# EAGLE design moth_v2 (EAGLE 9.4.1)
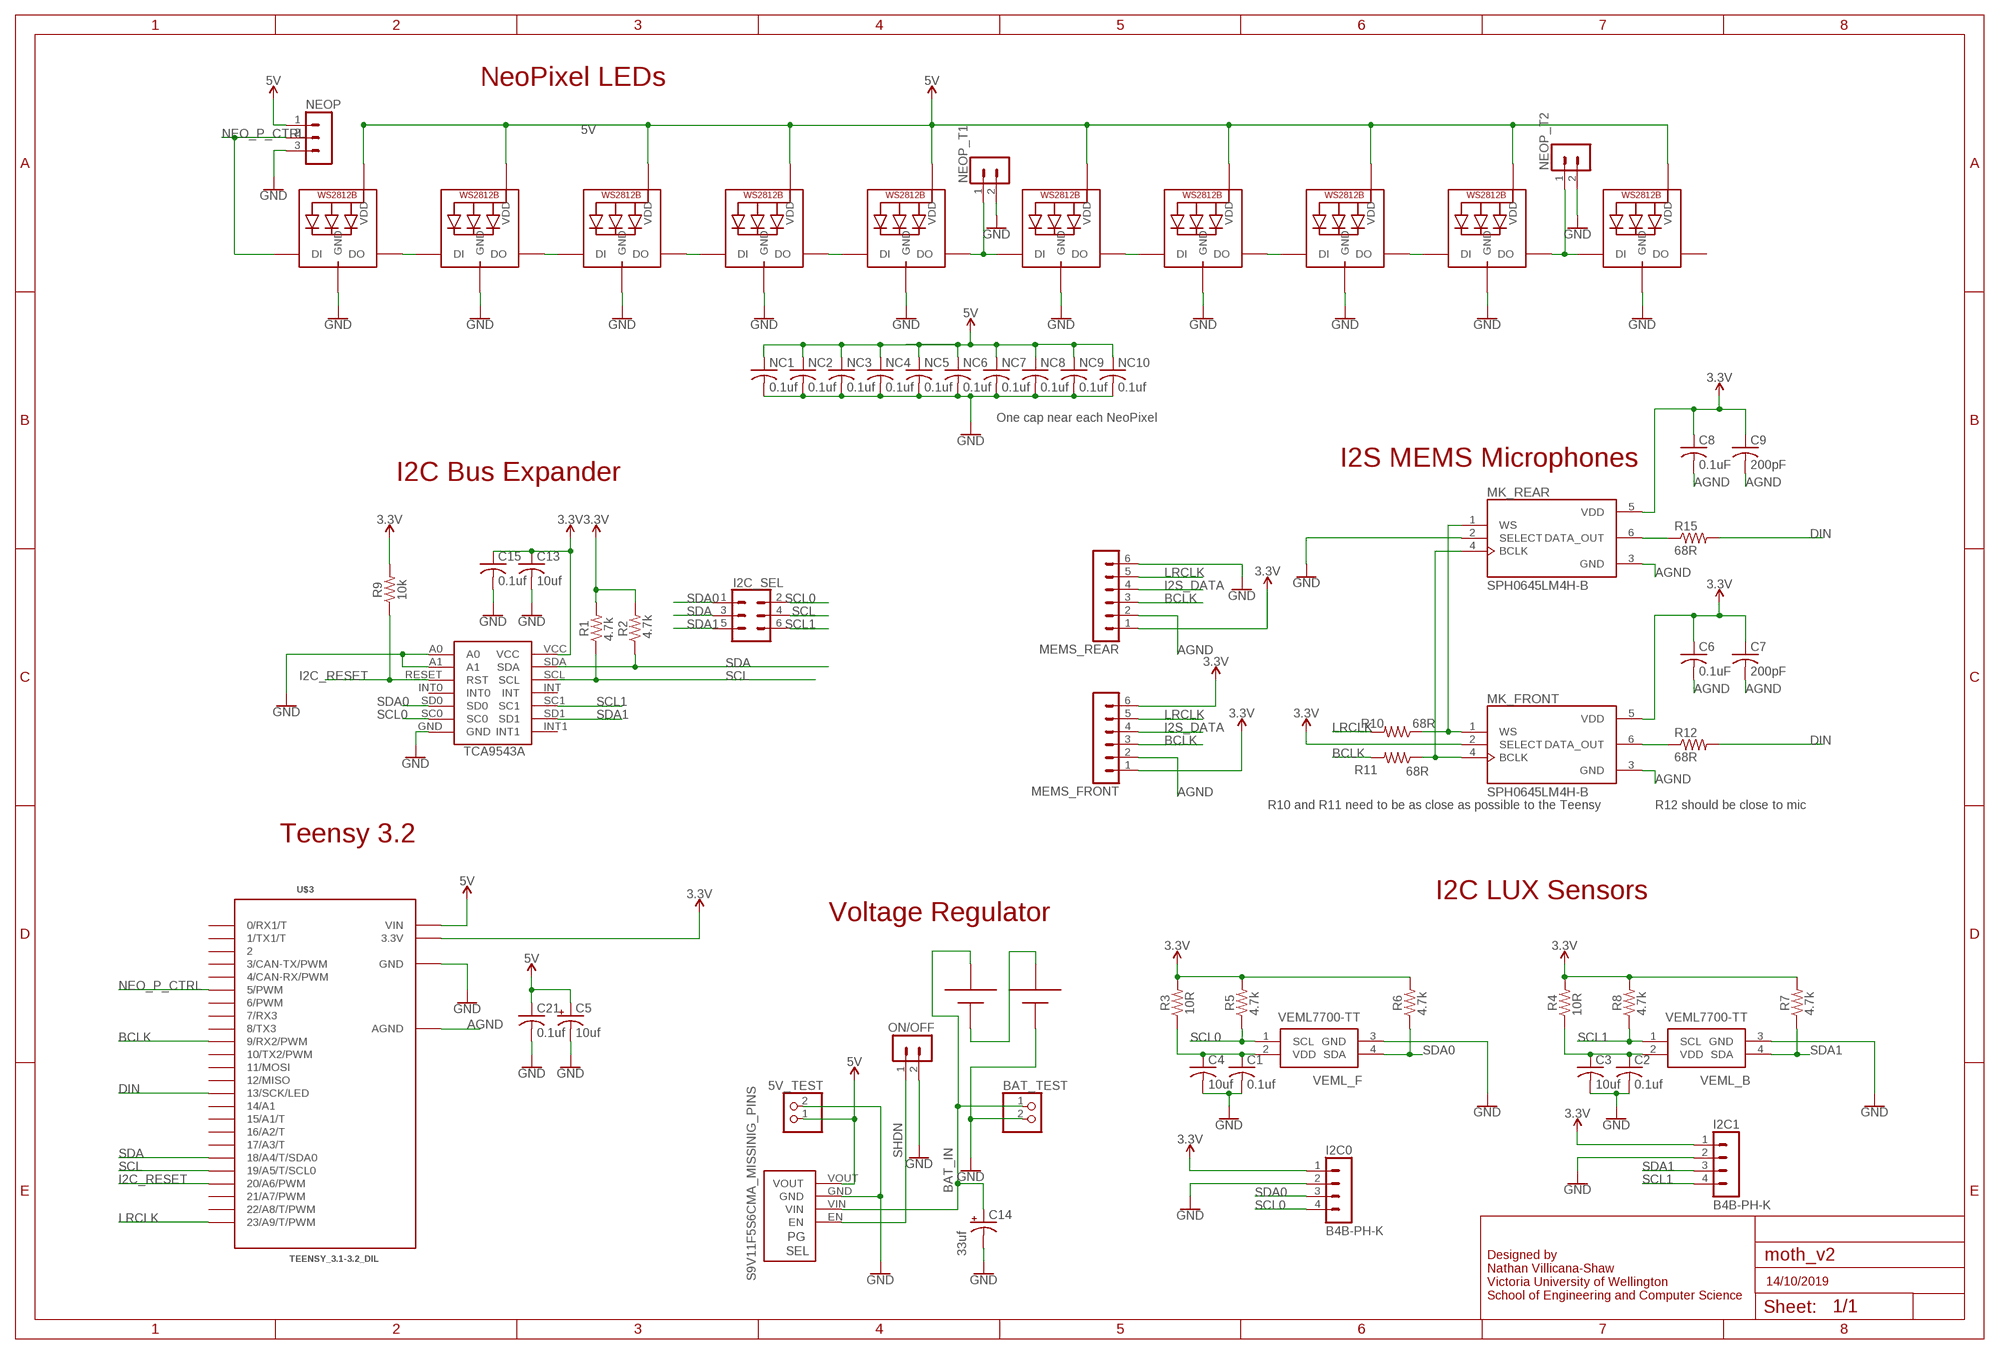
[diagram p0: schematic, sheet 1]

## Parts
5V_TEST  PINHD-1X2  [1X02]
BAT_TEST  PINHD-1X2  [1X02]
C1  0.1uf  C-USC1206K  [C1206K]
C2  0.1uf  C-USC1206K  [C1206K]
C3  10uf  C-USC1206K  [C1206K]
C4  10uf  C-USC1206K  [C1206K]
C5  10uf  CPOL-USE2.5-6  [E2,5-6]
C6  0.1uF  C-USC1206K  [C1206K]
C7  200pF  C-USC1206K  [C1206K]
C8  0.1uF  C-USC1206K  [C1206K]
C9  200pF  C-USC1206K  [C1206K]
C13  10uf  C-USC1206K  [C1206K]
C14  33uf  CPOL-USE2-5  [E2-5]
C15  0.1uf  C-USC1206K  [C1206K]
C21  0.1uf  C-USC1206K  [C1206K]
I2C0  B4B-PH-K  [B4B-PH-K]
I2C1  B4B-PH-K  [B4B-PH-K]
I2C_SEL  FEMALE 2x3  CONN_03X2FEMALE  [2X3]
MEMS_FRONT  B6B-PH-K  [B6B-PH-K]
MEMS_REAR  B6B-PH-K  [B6B-PH-K]
MK_FRONT  SPH0645LM4H-B  [MIC_SPH0645LM4H-B]
MK_REAR  SPH0645LM4H-B  [MIC_SPH0645LM4H-B]
NC1  0.1uf  C-USC1206K  [C1206K]
NC2  0.1uf  C-USC1206K  [C1206K]
NC3  0.1uf  C-USC1206K  [C1206K]
NC4  0.1uf  C-USC1206K  [C1206K]
NC5  0.1uf  C-USC1206K  [C1206K]
NC6  0.1uf  C-USC1206K  [C1206K]
NC7  0.1uf  C-USC1206K  [C1206K]
NC8  0.1uf  C-USC1206K  [C1206K]
NC9  0.1uf  C-USC1206K  [C1206K]
NC10  0.1uf  C-USC1206K  [C1206K]
NEO1  WS2812B5050  [WS2812B]
NEO2  WS2812B5050  [WS2812B]
NEO3  WS2812B5050  [WS2812B]
NEO4  WS2812B5050  [WS2812B]
NEO5  WS2812B5050  [WS2812B]
NEO6  WS2812B5050  [WS2812B]
NEO7  WS2812B5050  [WS2812B]
NEO8  WS2812B5050  [WS2812B]
NEO9  WS2812B5050  [WS2812B]
NEO10  WS2812B5050  [WS2812B]
NEOP  B3B-PH-K  [B3B-PH-K]
NEOP_T1  B2B-PH-K  [B2B-PH-K]
NEOP_T2  B2B-PH-K  [B2B-PH-K]
ON/OFF  B2B-PH-K  [B2B-PH-K]
R1  4.7k  R-US_R1206W  [R1206W]
R2  4.7k  R-US_R1206W  [R1206W]
R3  10R  R-US_R1206W  [R1206W]
R4  10R  R-US_R1206W  [R1206W]
R5  4.7k  R-US_R1206W  [R1206W]
R6  4.7k  R-US_R1206W  [R1206W]
R7  4.7k  R-US_R1206W  [R1206W]
R8  4.7k  R-US_R1206W  [R1206W]
R9  10k  R-US_R1206W  [R1206W]
R10  68R  R-US_M1206  [M1206]
R11  68R  R-US_M1206  [M1206]
R12  68R  R-US_M1206  [M1206]
R15  68R  R-US_M1206  [M1206]
U$1  TCA9543A  [SO14]
U$2  BK-18650-PC4  [18650-PC4]
U$3  TEENSY_3.1-3.2_DIL  [TEENSY_3.0-3.2&LC_DIL]
U$6  S9V11F5S6CMA_MISSINIG_PINS  [S9V11F3S5CMA_MISSING_PINS]
VEML_B  VEML7700-TT  [VEML7700]
VEML_F  VEML7700-TT  [VEML7700]

## Nets
3.3V: C6.1 C7.1 C8.1 C9.1 C13.1 C15.1 I2C0.1 I2C1.1 MEMS_FRONT.1 MEMS_FRONT.6 MEMS_REAR.1 MK_FRONT.2(SELECT) MK_FRONT.5(VDD) MK_REAR.5(VDD) R1.2 R2.2 R3.2 R4.2 R5.2 R6.2 R7.2 R8.2 R9.2 U$1.VCC U$3.3.3V
5V: 5V_TEST.1 C5.+ C21.1 NC1.1 NC2.1 NC3.1 NC4.1 NC5.1 NC6.1 NC7.1 NC8.1 NC9.1 NC10.1 NEO1.1-VDD(VDD) NEO2.1-VDD(VDD) NEO3.1-VDD(VDD) NEO4.1-VDD(VDD) NEO5.1-VDD(VDD) NEO6.1-VDD(VDD) NEO7.1-VDD(VDD) NEO8.1-VDD(VDD) NEO9.1-VDD(VDD) NEO10.1-VDD(VDD) NEOP.1 U$3.VIN U$6.VOUT
AGND: C6.2 C7.2 C8.2 C9.2 MEMS_FRONT.2 MEMS_REAR.2 MK_FRONT.3(GND) MK_REAR.3(GND) U$3.AGND
BAT_IN: BAT_TEST.1 C14.+ U$2.+1 U$6.VIN
BCLK: MEMS_FRONT.3 MEMS_REAR.3 R11.2 U$3.9(9/RX2/PWM)
BCLK_P: MK_FRONT.4(BCLK) MK_REAR.4(BCLK) R11.1
DIN: R12.2 R15.2 U$3.13(13/SCK/LED)
GND: 5V_TEST.2 BAT_TEST.2 C1.2 C2.2 C3.2 C4.2 C5.- C13.2 C14.- C15.2 C21.2 I2C0.2 I2C1.2 MEMS_REAR.6 MK_REAR.2(SELECT) NC1.2 NC2.2 NC3.2 NC4.2 NC5.2 NC6.2 NC7.2 NC8.2 NC9.2 NC10.2 NEO1.3-GND(GND) NEO2.3-GND(GND) NEO3.3-GND(GND) NEO4.3-GND(GND) NEO5.3-GND(GND) NEO6.3-GND(GND) NEO7.3-GND(GND) NEO8.3-GND(GND) NEO9.3-GND(GND) NEO10.3-GND(GND) NEOP.3 NEOP_T1.2 NEOP_T2.2 ON/OFF.2 U$1.A0 U$1.A1 U$1.GND U$2.-2 U$3.GND U$6.GND VEML_B.3(GND) VEML_F.3(GND)
I2C_RESET: R9.1 U$1.RESET(RST) U$3.20/A6(20/A6/PWM)
I2S_DATA: MEMS_FRONT.4 MEMS_REAR.4
LRCLK: MEMS_FRONT.5 MEMS_REAR.5 R10.2 U$3.23/A9(23/A9/T/PWM)
LRCLK_P: MK_FRONT.1(WS) MK_REAR.1(WS) R10.1
N$1: C1.1 C4.1 R3.1 VEML_F.2(VDD)
N$2: C2.1 C3.1 R4.1 VEML_B.2(VDD)
N$3: MK_FRONT.6(DATA_OUT) R12.1
N$4: NEO2.2-DOUT(DO) NEO3.4-DIN(DI)
N$5: NEO5.2-DOUT(DO) NEO6.4-DIN(DI) NEOP_T1.1
N$6: NEO9.2-DOUT(DO) NEO10.4-DIN(DI) NEOP_T2.1
N$8: NEO4.2-DOUT(DO) NEO5.4-DIN(DI)
N$10: NEO3.2-DOUT(DO) NEO4.4-DIN(DI)
N$11: NEO7.2-DOUT(DO) NEO8.4-DIN(DI)
N$12: NEO8.2-DOUT(DO) NEO9.4-DIN(DI)
N$17: MK_REAR.6(DATA_OUT) R15.1
N$20: U$2.+2 U$2.-1
N$23: NEO6.2-DOUT(DO) NEO7.4-DIN(DI)
NEO_P1: NEO1.2-DOUT(DO) NEO2.4-DIN(DI)
NEO_P_CTRL: NEO1.4-DIN(DI) NEOP.2 U$3.5(5/PWM)
SCL: I2C_SEL.4 R1.1 U$1.SCL U$3.19/A5(19/A5/T/SCL0)
SCL0: I2C0.4 I2C_SEL.2 R5.1 U$1.SC0 VEML_F.1(SCL)
SCL1: I2C1.4 I2C_SEL.6 R8.1 U$1.SC1 VEML_B.1(SCL)
SDA: I2C_SEL.3 R2.1 U$1.SDA U$3.18/A4(18/A4/T/SDA0)
SDA0: I2C0.3 I2C_SEL.1 R6.1 U$1.SD0 VEML_F.4(SDA)
SDA1: I2C1.3 I2C_SEL.5 R7.1 U$1.SD1 VEML_B.4(SDA)
SHDN: ON/OFF.1 U$6.EN
Unconnected: NEO10.2-DOUT(DO) U$1.INT U$1.INT0 U$1.INT1 U$3.0(0/RX1/T) U$3.1(1/TX1/T) U$3.2 U$3.3(3/CAN-TX/PWM) U$3.4(4/CAN-RX/PWM) U$3.6(6/PWM) U$3.7(7/RX3) U$3.8(8/TX3) U$3.10(10/TX2/PWM) U$3.11(11/MOSI) U$3.12(12/MISO) U$3.14/A0(14/A1) U$3.15/A1(15/A1/T) U$3.16/A2(16/A2/T) U$3.17/A3(17/A3/T) U$3.21/A7(21/A7/PWM) U$3.22/A8(22/A8/T/PWM)

## Notes on the sheet
- NeoPixel LEDs
- One cap near each NeoPixel
- I2S MEMS Microphones
- I2C Bus Expander
- 10k
- 4.7k | 4.7k
- R10 and R11 need to be as close as possible to the Teensy | R12 should be close to mic
- Teensy 3.2
- I2C LUX Sensors
- Voltage Regulator
- 10R | 4.7k | 4.7k | 10R | 4.7k | 4.7k
- 14/10/2019
- Designed by
  Nathan Villicana-Shaw
  Victoria University of Wellington
  School of Engineering and Computer Science

## Library data of the parts
5V_TEST BAT_TEST = pinhead:PINHD-1X2: PIN HEADER
C1-C4 C6-C9 C13 C15 C21 NC1-NC10 = adafruit:C-US: CAPACITOR, American symbol
C5 C14 = adafruit:CPOL-US: POLARIZED CAPACITOR, American symbol
I2C0 I2C1 = con-jst-ph:B4B-PH-K: HEADER
I2C_SEL = SparkFun-Connectors:CONN_03X2: Multi connection point. Often used as Generic Header-pin footprint for 0.1 inch spaced/style header connections You can populate with any combo of single row headers, but if you'd like an exact match, check these: Header - 2x3 (Male, 0.1") <https://www.sparkfun.com/products/12807> (PRT-12807) Header - 2x3 (Female, 0.1") <https://www.sparkfun.com/products/13010> (PRT-13010) 2x3 Pin Shrouded Header <https://www.sparkfun.com/products/10877> (PRT-10877) On any of the 0.1 inch spaced packages, you can populate with these: Break Away Headers - Straight <https://www.sparkfun.com/products/116> (PRT-00116) Break Away Male Headers - Right Angle <https://www.sparkfun.com/products/553> (PRT-00553) Female Headers <https://www.sparkfun.com/products/115> (PRT-00115) Break Away Headers - Machine Pin <https://www.sparkfun.com/products/117> (PRT-00117) Break Away Female Headers - Swiss Machine Pin <https://www.sparkfun.com/products/743> (PRT-00743) Special note: the shrouded connector mates well with our 3x2 ribbon cables: Ribbon Crimp Connector - 6-pin (2x3, Female) <https://www.sparkfun.com/products/10651> (PRT-10651) Ribbon Cable - 6 wire (15ft) <https://www.sparkfun.com/products/10646> (PRT-10646); PROD_ID: CONN-11566
MEMS_FRONT MEMS_REAR = con-jst-ph:B6B-PH-K: HEADER
MK_FRONT MK_REAR = SPH0645LM4H-B:SPH0645LM4H-B: Mic Mems Digital I2s Omni -26db; DESCRIPTION: Mic Mems Digital I2s Omni -26db; DIGI-KEY_PART_NUMBER: 423-1405-1-ND; DIGI-KEY_PURCHASE_URL: https://www.digikey.co.nz/product-detail/en/knowles/SPH0645LM4H-B/423-1405-1-ND/5332432?utm_source=snapeda&utm_medium=aggregator&utm_campaign=symbol; MF: Knowles; MP: SPH0645LM4H-B; PACKAGE: SIP-7 Bourns
NEO1-NEO10 = adafruit:WS2812B
NEOP = con-jst-ph:B3B-PH-K: HEADER
NEOP_T1 NEOP_T2 ON/OFF = con-jst-ph:B2B-PH-K: HEADER
R1-R12 R15 = adafruit:R-US_: RESISTOR, American symbol
U$1 = nathans-custom-parts:TCA9543A
U$2 = BK-18650-PC4:BK-18650-PC4; AVAILABILITY: Unavailable; DESCRIPTION: Holder Batt Li-Ion 2cell 4pc Pin; MF: MPD; MP: BK-18650-PC4; PACKAGE: None; PRICE: None
U$3 = Teensy_3_and_LC_Series_Boards_v1.4:TEENSY_3.1-3.2_DIL: Teensy 3.1 or 3.2 in a DIL Layout.
U$6 = nathans-custom-parts:S9V11F5S6CMA_MISSINIG_PINS
VEML_B VEML_F = VEML7700-TT:VEML7700-TT: 16Bit Ambient Light Sensor I2C 6.8x2.3mm Source: Datasheet <https://www.arrow.com/en/products/veml7700-tt/vishay>; DESCRIPTION: 16Bit Ambient Light Sensor I2C 6.8x2.3mm; HEIGHT: mm; MANUFACTURER_NAME: Vishay; MANUFACTURER_PART_NUMBER: VEML7700-TT; MOUSER_PART_NUMBER: 78-VEML7700-TT; MOUSER_PRICE-STOCK: https://www.mouser.com/Search/Refine.aspx?Keyword=78-VEML7700-TT; RS_PART_NUMBER: 1226791P; RS_PRICE-STOCK: http://uk.rs-online.com/web/p/products/1226791P

## Net classes
0 default: width 0.203 mm, drill 0.254 mm, clearance 0.203 mm

## Board
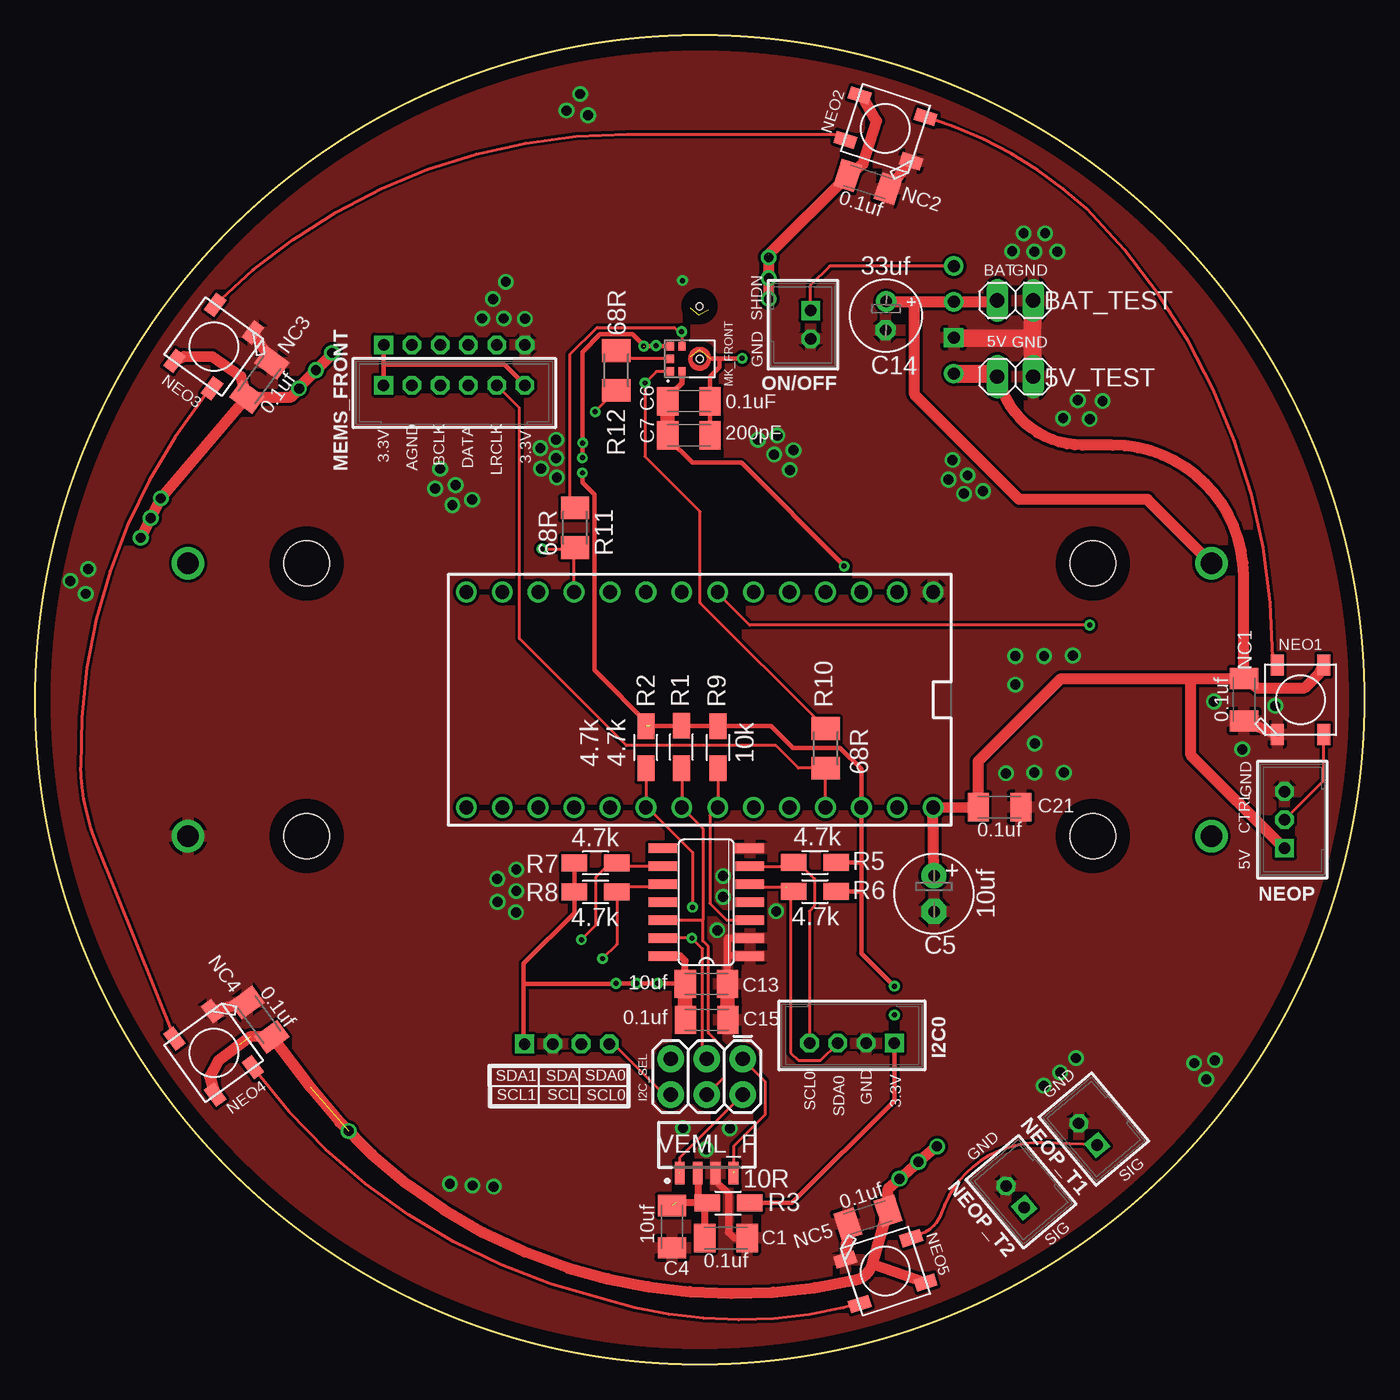
[diagram p1: board, top side]
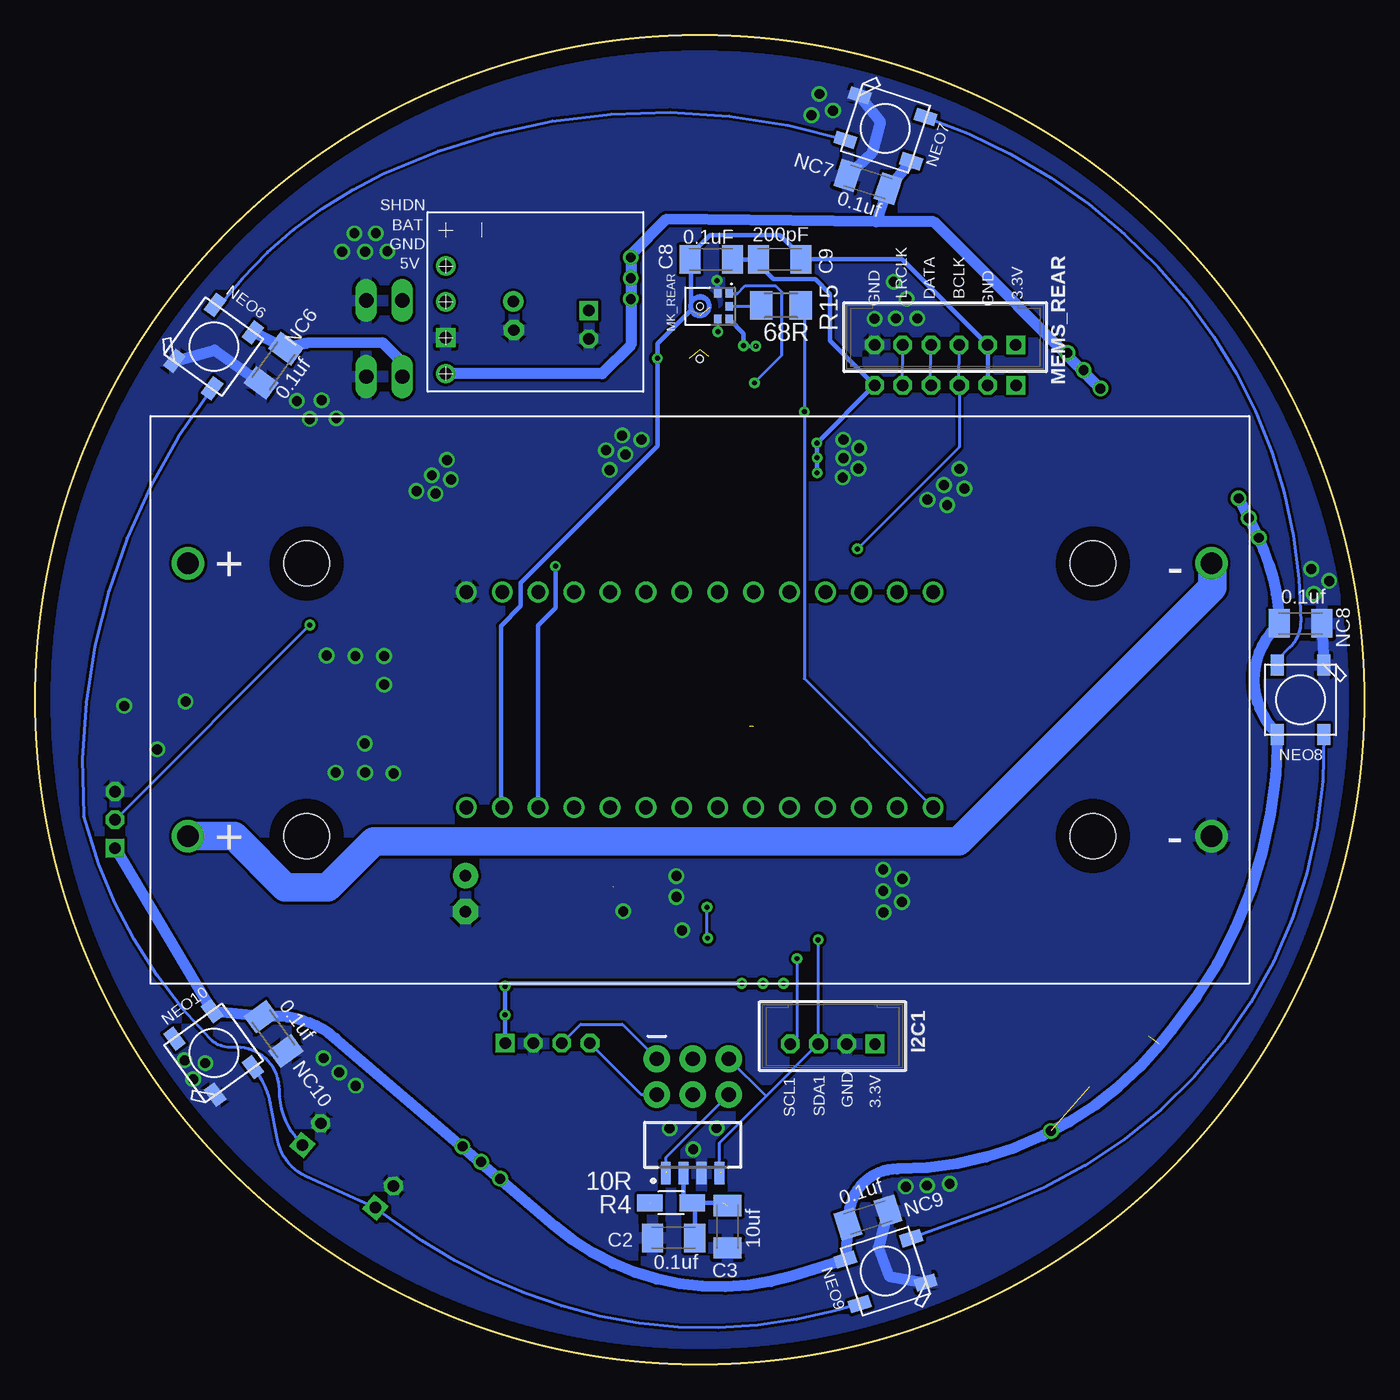
[diagram p2: board, bottom side, seen from below]

Size 94 x 94 mm. Coordinates in mm from the lower left corner, seen from the top.
Outline: circle at 47,47 radius 47
Copper layers (1*16): Top 0.035mm / dielectric 1.5mm / Bottom 0.035mm
Design rules "PCBway": minimum track width 6mil, minimum drill 0.3mm, track to track 0.205mm, track to pad 0.205mm, pad to pad 0.205mm, via to via 0.205mm, smd to smd 8mil, copper to edge 40mil, drill to drill 8mil, minimum pad ring 10mil, minimum via ring 8mil, stop-mask expansion 4mil, vias tented up to drill 25mil, thermal gap 10mil

### Footprints (pad centres in the part's own frame; a part is rotated, then mirrored left to right if it is on the bottom)
1X02 = drill 1.016 long: 1 -1.27,0; 2 1.27,0
C1206K = smd 1.5 x 2: 1 -1.5,0; 2 1.5,0
E2,5-6 = drill 0.813 pad 1.778: + -1.27,0 | drill 0.813 pad 1.778 octagon: - 1.27,0
E2-5 = drill 0.813 pad 1.422: + -1.016,0 | drill 0.813 pad 1.422 octagon: - 1.016,0
B4B-PH-K = drill 0.813 square: 1 -3,0 | drill 0.813 octagon: 2 -1,0; 3 1,0; 4 3,0
2X3 = drill 1.016 pad 1.88: 1 0,0; 2 0,2.54; 3 2.54,0; 4 2.54,2.54; 5 5.08,0; 6 5.08,2.54
B6B-PH-K = drill 0.813 square: 1 -5,0 | drill 0.813 octagon: 2 -3,0; 3 -1,0; 4 1,0; 5 3,0; 6 5,0
MIC_SPH0645LM4H-B = smd 0.6 x 0.522: 1 -0.9,2.074; 2 -0.9,1.252; 4 0.9,1.252; 5 0.9,2.074; 6 0,2.074 | smd 0.1 x 0.1: 3 0.65,0.02 | hole 0.5: 0,0
WS2812B = smd 1.5 x 0.9: 1-VDD 2.45,-1.65; 2-DOUT 2.45,1.65; 3-GND -2.45,1.65; 4-DIN -2.45,-1.65
B3B-PH-K = drill 0.813 square: 1 -2,0 | drill 0.813 octagon: 2 0,0; 3 2,0
B2B-PH-K = drill 0.813 square: 1 -1,0 | drill 0.813 octagon: 2 1,0
R1206W = smd 1.8 x 1.2: 1 -1.499,0; 2 1.499,0
M1206 = smd 1.6 x 2: 1 -1.4,0; 2 1.4,0
SO14 = smd 0.66 x 2.032: A0 -3.81,-3.073; A1 -2.54,-3.073; GND 3.81,-3.073; INT 0,3.073; INT0 0,-3.073; INT1 3.81,3.073; RESET -1.27,-3.073; SC0 2.54,-3.073; SC1 1.27,3.073; SCL -1.27,3.073; SD0 1.27,-3.073; SD1 2.54,3.073; SDA -2.54,3.073; VCC -3.81,3.073
18650-PC4 = drill 1.524: +1 -36.195,9.652; +2 -36.195,-9.652; -1 36.195,9.652; -2 36.195,-9.652 | hole 3.2: -27.813,9.652; -27.813,-9.652; 27.813,-9.652; 27.813,9.652
TEENSY_3.0-3.2&LC_DIL = drill 0.965: 0 -7.62,13.97; 1 -7.62,11.43; 2 -7.62,8.89; 3 -7.62,6.35; 3.3V 7.62,11.43; 4 -7.62,3.81; 5 -7.62,1.27; 6 -7.62,-1.27; 7 -7.62,-3.81; 8 -7.62,-6.35; 9 -7.62,-8.89; 10 -7.62,-11.43; 11 -7.62,-13.97; 12 -7.62,-16.51; 13 7.62,-16.51; 14/A0 7.62,-13.97; 15/A1 7.62,-11.43; 16/A2 7.62,-8.89; 17/A3 7.62,-6.35; 18/A4 7.62,-3.81; 19/A5 7.62,-1.27; 20/A6 7.62,1.27; 21/A7 7.62,3.81; 22/A8 7.62,6.35; 23/A9 7.62,8.89; AGND 7.62,13.97; GND -7.62,16.51; VIN 7.62,16.51
S9V11F3S5CMA_MISSING_PINS = drill 0.85: EN 0,0; VIN 2.54,0; VOUT 7.62,0 | drill 0.85 square: GND 5.08,0
VEML7700 = smd 0.7 x 1.6: 1 1.495,-0.4; 2 2.765,-0.4; 3 4.035,-0.4; 4 5.305,-0.4

### Placement (x,y rotation side)
5V_TEST  69.32,69.86 0 top
BAT_TEST  69.32,75.25 0 top
C1  48.85,8.92 0 top
C2  48.85,8.93 180 bottom
C3  45.04,9.72 270 bottom
C4  45.04,9.72 270 top
C5  63.57,33.29 270 top
C6  46.23,68.12 0 top
C7  46.23,65.71 0 top
C8  46.19,78.14 180 bottom
C9  41.35,78.16 0 bottom
C13  47.47,26.89 0 top
C14  60.17,74.16 269 top
C15  47.49,24.35 0 top
C21  68.21,39.4 0 top
I2C0  57.77,22.7 180 top
I2C1  37.61,22.65 180 bottom
I2C_SEL  50.03,21.6 180 top
MEMS_FRONT  29.63,69.25 0 top
MEMS_REAR  29.64,72.11 180 bottom
MK_FRONT  46.99,71.11 90 top
MK_REAR  46.98,74.84 270 bottom
NC1  85.5,47 270 top
NC2  58.9,83.62 342 top
NC3  15.85,69.63 54 top
NC4  15.85,24.37 126 top
NC5  58.9,10.38 198 top
NC6  77.15,70.63 234 bottom
NC7  35.1,83.62 162 bottom
NC8  4.5,52.4 0 bottom
NC9  35.1,10.38 18 bottom
NC10  77.15,23.37 306 bottom
NEO1  89.5,47 90 top
NEO2  60.13,87.42 162 top
NEO3  12.62,71.98 234 top
NEO4  12.62,22.02 306 top
NEO5  60.13,6.58 18 top
NEO6  81.38,71.98 54 bottom
NEO7  33.87,87.42 342 bottom
NEO8  4.5,47 270 bottom
NEO9  33.87,6.58 198 bottom
NEO10  81.38,22.02 126 bottom
NEOP  88.36,38.51 90 top
NEOP_T1  74.46,16.27 130 top
NEOP_T2  69.31,11.83 130 top
ON/OFF  54.85,73.53 270 top
R1  45.7,43.66 90 top
R2  43.18,43.64 90 top
R3  49.02,11.4 0 top
R4  49.03,11.41 180 bottom
R5  55.15,35.49 0 top
R6  55.16,33.43 0 top
R7  39.63,35.46 180 top
R8  39.63,33.4 180 top
R9  48.3,43.64 90 top
R10  55.91,43.57 270 top
R11  38.18,59.17 270 top
R12  41.1,70.3 270 top
R15  41.26,74.89 0 bottom
U$1  47.46,32.68 90 top
U$2  47,47 0 bottom
U$3  47,47 270 top
U$6  64.97,77.69 270 bottom
VEML_B  50.9,13.91 0 bottom
VEML_F  44.09,13.92 0 top

### Tracks (layer width: path | path; a pad name or v marks a point on that pad's centre or on a via)
3.3V  (via drill 0.35)  (4 unrouted)
  Top 0.305: MK_FRONT.5 43.52,72.01 | 43.52,72.01 43.52,72.02 | 43.52,72.01 43.09,72.01 42.25,72.85 39.95,72.85 38.69,71.59 v38.69,64.12 | 43.48,45.16 39.54,49.1 39.54,61.52 38.69,62.36 v38.69,63.05 | C7.1 44.73,65.5 46.47,63.76 49.95,63.76 57.21,56.5 v57.21,56.45 | MEMS_REAR.1 24.64,70.7 | 24.64,70.7 MEMS_FRONT.1 | MEMS_FRONT.6 33.19,70.7 24.64,70.7 | R2.2 45.69,45.14 R1.2 48.28,45.16 R9.2 52.04,45.14 53.6,43.57 56.91,43.57 56.93,43.6 58.43,42.1 U$3.3.3V 58.43,35.44 | 58.43,35.44 58.43,33.41 | 58.43,33.41 58.43,29.07 v60.77,26.73 | R7.2 R8.2 38.13,31.94 34.55,28.36 34.55,26.91 | 34.55,26.91 34.55,22.7 I2C1.1 | 34.55,26.91 41.06,26.91 v41.08,26.93 v42.53,26.93 v44.03,26.93 45.93,26.93 C13.1 | I2C0.1 60.77,18.63 53.54,11.4 R3.2 | R5.2 58.38,35.49 58.43,35.44 | R6.2 58.41,33.43 58.43,33.41
  Top 0.406: MK_FRONT.2 45.74,69.41 44.73,68.41 C6.1
  Top 0.508: C13.1 45.97,28.55 45.63,28.89 44.41,28.89 U$1.VCC
  Top 0.787: R5.2 56.68,35.52 | 43.2,45.16 43.09,45.04 | 45.96,26.91 C13.1
  Top 1.016: R3.2 50.48,11.4 | C6.1 C7.1 | 43.09,45.04 R2.2 | C15.1 45.97,24.37 45.97,24.88 | 45.97,24.88 C13.1 | 45.95,24.85 45.97,24.88 | R7.2
  Bottom 0.203: 41.72,76.69 41.78,76.76 42.86,77.83 42.86,78.14
  Bottom 0.305: C8.1 42.86,78.14 C9.1 42.85,77.82 41.78,76.76 41.77,76.75 38.82,76.75 37.78,75.7 37.78,72.4 MEMS_FRONT.6 v38.72,65.16 | v57.21,56.45 57.21,53.48 58.43,52.26 U$3.3.3V | v38.72,65.16 38.72,65.14 | v38.72,65.16 38.72,64.12 v38.69,64.12 v38.69,63.05 38.69,62.93 | v44.03,26.93 60.56,26.93 v60.77,26.73 v60.77,24.7 I2C0.1 | MK_REAR.5 43.9,72.88 v43.9,72.04 43.9,71.99 43.09,72.02
  other vias: 43.04,72.02
5V  (via drill 0.7)  (3 unrouted)
  Top 0.305: NC5.1 60.17,10.39 60.03,9.94 | 62.37,5.8 NEO5.1-VDD | 58.71,89.29 NEO2.1-VDD
  Top 0.787: C5.+ U$3.VIN C21.1 66.71,42.65 72.55,48.5 81.75,48.5 | NEO4.1-VDD 12.33,20.33 12.93,21.45 15.22,23.18 NC4.1 19.45,19.61 arc35 37.64,6.83 arc30 58.02,5.95 arc61 59.2,7.06 | NC3.1 14.54,69.87 12.53,71.25 10.53,71.28 NEO3.1-VDD | 58.71,89.29 59.51,87.94 58.55,84.9 NC2.1 51.88,78.48 51.88,75.3 | NC1.1 86.47,47.81 89.8,47.84 90.81,48.85 NEO1.1-VDD | NC3.1 8.92,61.3 v8.88,61.25 v8.16,59.85 v7.45,58.45 | 59.2,7.06 60.17,10.39 | NEO5.1-VDD 59.2,7.06 | NC1.1 85.47,55.77 arc90 76.2,65.01 74.07,65.01 arc-68 68.45,68.79 67.99,69.91 | NC5.1 60.32,12.42 v61.12,13.12 v62.47,14.31 v63.79,15.4 | 81.75,48.5 NC1.1 | NEOP.1 88.3,36.51 81.75,43.06 81.75,48.5 | NC3.1 18.1,68.42 18.65,68.97 v18.65,69.02 18.65,69.12 v19.85,70.32 20.99,71.46 v20.99,71.54
  Top 1.27: U$6.VOUT 67.84,70.07 67.99,69.91 5V_TEST.1
  Bottom 0.787: v8.88,61.25 7.54,58.54 arc24 NC8.1 6.34,52.04 arc-83 6.61,45.1 NEO8.1-VDD arc39 13.59,23.67 14.44,22.63 arc51 33.03,13.8 arc-83 36.43,10.76 NC9.1 NEO9.1-VDD 40.37,6.27 arc58 57.26,9.77 72.79,23.06 arc-43 77.24,24.61 NC10.1 NEO10.1-VDD NEOP.1 | 5V_TEST.1 68.06,70.9 69.42,72.26 74.82,72.22 NC6.1 NEO6.1-VDD | NEO7.1-VDD NC7.1 34.3,81.44 | 34.3,81.44 34.53,80.81 30.44,80.81 v18.65,69.02 | 34.3,81.44 34.52,80.84 49.38,80.99 51.88,78.5 v51.88,78.29 v51.88,76.82 v51.88,75.35 51.88,72.09 53.91,70.07 U$6.VOUT
  other vias: 22.16,16.49
AGND  (via drill 0.35)  (4 unrouted)
  Top 0.305: v50,71.16 50,71.13 48.42,71.13 | C7.2 C6.2 47.73,69.85 48.41,70.53 48.41,71.12 48.42,71.13 | 48.42,71.13 47.76,71.13 | 46.34,70.98 46.34,71.26
  Bottom 0.305: U$3.AGND 61.07,39.48 61.07,52.23 59.67,53.63 59.67,55.26 50,64.93 v50,71.16 50,72.2 47.63,74.56 47.63,78.09 C8.2 47.69,78.44 46.26,79.87 41.34,79.87 40.4,78.93 40.4,78.71 C9.2 32.69,78.16 MEMS_REAR.2 MEMS_FRONT.2 | 46.31,74.74 46.31,74.91
BAT_IN
  Top 0.787: U$2.+1 78.67,61.17 69.61,61.17 62.19,68.59 62.19,75.15 | 67.94,75.15 U$6.VIN 62.19,75.15 | C14.+ 62.16,75.18 62.19,75.15
  Top 1.016: 67.94,75.15 BAT_TEST.1
BCLK  (via drill 0.35)
  Top 0.203: U$3.9 38.11,57.69 R11.2 38.08,57.67 v35.85,57.67
  Bottom 0.203: MEMS_REAR.3 28.66,69.28 MEMS_FRONT.3 28.63,64.88 v35.85,57.67
BCLK_P  (via drill 0.35)
  Top 0.203: R11.1 37.8,60.95 37.8,71.41 39.74,73.34 45.21,73.34 45.51,73.04 v45.72,73.04 45.74,73.04 MK_FRONT.4
  Bottom 0.203: MK_REAR.4 45.73,73.12 45.72,73.12 v45.72,73.04
DIN  (via drill 0.35)
  Top 0.203: v39.61,67.37 41.1,68.86 R12.2
  Bottom 0.203: U$3.13 39.61,48.5 v39.61,67.37 39.61,74.64 R15.2
GND  (via drill 0.35, 0.7)
  Top 0.508: C13.2 48.97,28.89 | 48.97,28.89 48.97,30.15 48.98,30.16 50.52,30.16 U$1.A1 | U$1.A0 48.99,28.87 48.97,28.89 | VEML_F.3 48.13,12.98 49.03,12.08 49.03,9.32 49.43,8.92 C1.2 | 57.29,7.43 NEO5.3-GND
  Top 0.787: NC3.2 NEO3.3-GND | NC2.2 NEO2.3-GND | NC1.2 NEO1.3-GND | NC5.2 57.29,7.43 | NC4.2 NEO4.3-GND
  Top 1.016: C13.2 48.97,24.37 C15.2
  Top 1.27: U$6.GND 70.52,72.58 | 70.52,72.58 BAT_TEST.2 | 5V_TEST.2 70.52,72.58
  Bottom 0.305: MK_REAR.2 45.73,76.61 v45.78,76.66
  Bottom 0.787: NC9.2 34.38,8.24 33.61,6.23 NEO9.3-GND | NC8.2 NEO8.3-GND | NEO7.3-GND 34.22,87.89 34.83,85.66 NC7.2 | NEO6.3-GND 81.31,71.74 NC6.2
  other vias: 70.7,43.9 70.67,41.84 68.67,41.79 72.76,41.84 73.39,50.12 71.36,50.1 69.33,50.1 69.33,48.07 73.75,68.18 72.7,66.91 75.5,68.13 74.58,66.86 87.72,46.57 83.37,46.87 85.38,43.49 28.64,63.33 29.73,62.19 30.9,61.15 28.28,61.94 29.5,60.77 34.02,34.99 34.02,33.46 34,31.96 32.7,32.7 32.67,34.33 64.88,63.97 65.95,62.88 67.04,61.76 64.6,62.57 65.69,61.58 69.1,78.72 70.67,78.7 72.3,78.7 71.43,79.99 69.91,79.99 31.61,73.97 33.13,73.97 34.63,73.95 32.37,75.35 33.28,76.57 36.84,65.39 36.84,64.09 36.89,62.72 35.77,63.36 35.72,64.81 51.11,65.39 52.26,64.35 53.38,63.26 53.63,64.65 52.49,65.69 37.58,88.68 39.1,88.35 38.54,89.85 3.57,54.49 2.47,55.41 3.74,56.25 29.32,12.76 30.92,12.63 32.42,12.56 81.98,21.3 82.84,20.15 83.45,21.5 73.62,21.65 72.5,20.63 71.33,19.7 48.65,33.06 48.65,34.53 48.24,30.69 52.41,32.04 49.13,16.67 47.46,15.2 45.81,16.7
  pour Top: -11,96 100,96 100,-5 -11,-5
  pour Bottom: 68.77,95.9 99.91,64.75 99.91,26.93 67.65,-5.32 28.81,-5.32 -11.27,34.76 -10.96,95.92
I2C_RESET
  Top 0.203: R9.1 48.3,39.41 U$3.20/A6 47.71,38.82 47.71,32.6 48.9,31.41 U$1.RESET
I2S_DATA
  Bottom 0.203: MEMS_FRONT.4 30.66,69.28 MEMS_REAR.4
LRCLK
  Top 0.203: MEMS_FRONT.5 34.25,67.64 34.25,51.32 41.82,43.75 52.38,43.75 53.97,42.17 R10.2 55.89,42.15 U$3.23/A9
  Bottom 0.203: MEMS_FRONT.5 32.66,69.28 MEMS_REAR.5
LRCLK_P  (via drill 0.35)
  Top 0.203: MK_FRONT.1 43.93,70.21 43.93,70.22 v43.13,69.42 43.13,64.21 47.02,60.31 47.02,53.85 R10.1
  Bottom 0.203: MK_REAR.1 44.34,75.74 43.8,76.29 41.89,76.29 41.89,76.28 41.64,76.28 41.21,75.85 41.21,71.36 v43.14,69.43 v43.13,69.42
N$1
  Top 0.508: 47.35,11.44 46.87,11.44 46.87,13.52 VEML_F.2 | C1.1 47.35,11.44 | 47.35,11.44 47.52,11.44 R3.1 45.68,11.41 C4.1
N$2  (1 unrouted)
  Bottom 0.305: VEML_B.2 48.14,11.46 48.09,11.41 R4.1 47.38,11.41 | 45.36,11.41 47.38,11.41 | C2.1 47.35,11.38 47.38,11.41
N$3
  Top 0.203: MK_FRONT.6 41.78,71.11 41.77,71.11 41.18,71.69 R12.1
N$4
  Top 0.203: NEO3.4-DIN 12.74,74.95 arc-45 41.84,87 56.33,87 arc-45 NEO2.2-DOUT
N$5
  Top 0.203: NEOP_T1.1 71.29,15.65 arc74 64.09,10.69 arc-48 62.74,9.24 NEO5.2-DOUT
  Bottom 0.203: NEO6.4-DIN 81.6,68.88 arc-41 90.57,38.82 90.41,38.23 arc-30 81.61,22.99 arc-45 80.24,22.42 79.74,22.42 arc90 76.73,19.41 arc-42 75.31,15.74 NEOP_T1.1
N$6
  Bottom 0.203: NEO9.2-DOUT 37.38,3.79 arc33 56.79,4.13 arc19 68.87,10.27 NEOP_T2.1 74.86,13.3 arc54 76.86,15.84 77.38,18.51 arc-30 NEO10.4-DIN
N$8
  Top 0.203: NEO4.2-DOUT 15.59,20.74 arc40 40,4.67 arc29 40,4.66 arc31 57.14,3.98 NEO5.4-DIN
N$10
  Top 0.203: NEO3.2-DOUT 11.94,68.46 arc40 3.22,42.21 arc20 4.34,36.79 9.84,23.09 arc41 NEO4.4-DIN
N$11
  Bottom 0.203: NEO7.2-DOUT 31.01,88.21 arc32 12.44,75.17 arc39 4.49,52.53 arc45 5.25,50.72 6.15,49.81 NEO8.4-DIN
N$12
  Bottom 0.203: NEO8.2-DOUT arc71 25.7,11.21 NEO9.4-DIN
N$17
  Bottom 0.203: MK_REAR.6 42.71,74.84 R15.1
N$20
  Bottom 2.032: U$2.+2 79.95,37.35 76.32,33.72 73.31,33.72 70.06,36.97 28.69,36.97 10.73,54.92 10.73,56.58 U$2.-1
N$23
  Bottom 0.203: NEO6.2-DOUT 80.93,74.93 arc27 69.39,84.2 arc42 NEO7.4-DIN
NEO_P1
  Top 0.203: NEO1.2-DOUT 87.85,49.65 87.54,49.97 arc45 74.38,81.74 arc25 NEO2.4-DIN
NEO_P_CTRL  (via drill 0.35)
  Top 0.203: NEOP.2 91.15,41.3 NEO1.4-DIN | v74.59,52.28 50.53,52.28 48.27,54.54 U$3.5
  Bottom 0.203: NEOP.2 v74.59,52.28
SCL
  Top 0.203: U$1.SCL 47.23,31.41 | I2C_SEL.4 48.75,20.31 48.75,22.29 47.61,23.43 47.61,29.55 47.23,29.92 47.23,31.41 | R1.1 45.73,42.13 U$3.19/A5 47.23,37.88 47.23,31.41
SCL0  (1 unrouted)
  Top 0.203: 50.51,35.19 U$1.SC0 53.12,35.22 53.15,35.19 53.35,35.19 R5.1 53.96,35.49 55.13,34.33 55.13,32.42 54.75,32.04 54.75,22.72 I2C0.4 | I2C_SEL.2 45.59,14.61 45.59,13.64 45.52,13.58
  Bottom 0.203: I2C0.4 51.12,19.05 I2C_SEL.2
SCL1  (via drill 0.35)
  Top 0.203: U$1.SC1 43.73,33.95 43.55,33.77 41.5,33.77 R8.1 41.13,29.7 v40.12,28.69 | I2C1.4 40.91,22.65 44.51,19.05 I2C_SEL.6
  Bottom 0.203: I2C_SEL.6 49.41,14.6 VEML_B.1 | v40.12,28.69 40.12,23.14 I2C1.4
SDA  (via drill 0.35)
  Top 0.203: I2C_SEL.3 47.2,21.89 47.2,29.38 v46.44,30.13 v46.44,30.14 U$1.SDA | R2.1 U$3.18/A4 43.32,39.38 46.49,36.2 v46.49,32.32
  Bottom 0.203: v46.44,30.13 46.52,30.21 46.52,32.29 v46.49,32.32
SDA0  (2 unrouted)
  Top 0.203: U$1.SD0 51.24,33.95 51.45,33.74 52.89,33.74 52.92,33.77 53.1,33.77 | 53.15,33.77 53.32,33.77 R6.1 53.43,33.2 53.43,22.03 53.98,21.47 55.54,21.47 I2C0.3 | I2C_SEL.1 51.62,20 51.62,17.64 49.4,15.41 49.4,13.64
  Bottom 0.203: I2C0.3 55.43,24.04 52.47,24.04 I2C_SEL.1
SDA1  (via drill 0.35)
  Top 0.203: U$1.SD1 41.37,35.22 R7.1 40.66,35.45 39.66,34.45 39.66,31.07 38.63,30.05 v38.63,30.02
  Bottom 0.203: VEML_B.4 45.6,15.67 42.33,18.94 | 42.33,18.94 38.62,22.65 I2C1.3 38.61,30.02 38.62,30.03 v38.63,30.02 | I2C_SEL.5 42.33,18.98 42.33,18.94
SHDN
  Top 0.203: U$6.EN 56.2,77.69 54.8,76.29 54.8,74.58
  Top 1.016: 54.8,74.58 ON/OFF.1

### Text on the board
tNames: GND | BAT | SHDN | GND | 5V | GND | 3.3V | BCLK | 3.3V | AGND | DATA | LRCLK | GND | CTRL | 5V | SDA1 | SDA | SDA0 | SDA0 | SCL1 | SCL | SCL0 | GND | SCL0 | GND | 3.3V | GND | SIG | SIG
bNames: SHDN | BAT | GND | GND | GND | 5V | 3.3V | BCLK | DATA | LRCLK | SDA1 | SCL1 | 3.3V | GND